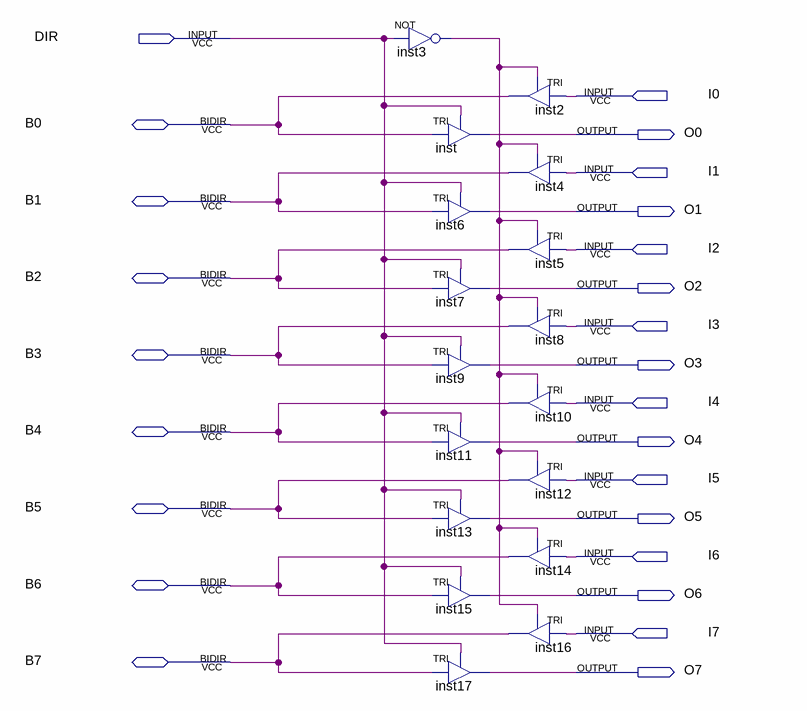
[diagram p0: schematic sheet]
// Quartus schematic 8bidir16.bdf as structural Verilog: 17 symbols, 25 pins
module \8bidir16  (
  input  DIR,
  input  I0,
  input  I1,
  input  I2,
  input  I3,
  input  I4,
  input  I5,
  input  I6,
  input  I7,
  inout  B0,
  inout  B1,
  inout  B2,
  inout  B3,
  inout  B4,
  inout  B5,
  inout  B6,
  inout  B7,
  output O0,
  output O1,
  output O2,
  output O3,
  output O4,
  output O5,
  output O6,
  output O7
);

  wire inst3_out;

  not inst3 (inst3_out, DIR);
  TRI inst (.IN(B0), .OE(DIR), .OUT(O0));
  TRI inst6 (.IN(B1), .OE(DIR), .OUT(O1));
  TRI inst7 (.IN(B2), .OE(DIR), .OUT(O2));
  TRI inst9 (.IN(B3), .OE(DIR), .OUT(O3));
  TRI inst11 (.IN(B4), .OE(DIR), .OUT(O4));
  TRI inst13 (.IN(B5), .OE(DIR), .OUT(O5));
  TRI inst15 (.IN(B6), .OE(DIR), .OUT(O6));
  TRI inst17 (.IN(B7), .OE(DIR), .OUT(O7));
  TRI inst2 (.IN(I0), .OE(inst3_out), .OUT(B0));
  TRI inst4 (.IN(I1), .OE(inst3_out), .OUT(B1));
  TRI inst5 (.IN(I2), .OE(inst3_out), .OUT(B2));
  TRI inst8 (.IN(I3), .OE(inst3_out), .OUT(B3));
  TRI inst10 (.IN(I4), .OE(inst3_out), .OUT(B4));
  TRI inst12 (.IN(I5), .OE(inst3_out), .OUT(B5));
  TRI inst14 (.IN(I6), .OE(inst3_out), .OUT(B6));
  TRI inst16 (.IN(I7), .OE(inst3_out), .OUT(B7));
endmodule
